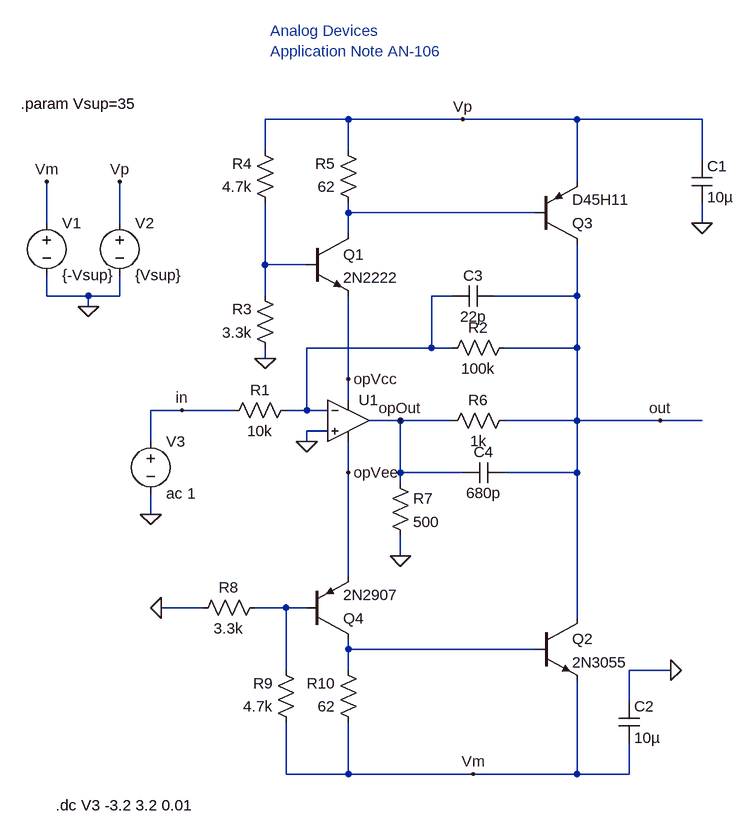
[diagram p0: schematic OpAmp_bootstrap.asc]
OpAmp_bootstrap.asc, the LTspice schematic file:
Version 4
SHEET 1 880 1008
WIRE 128 -64 0 -64
WIRE 304 -64 128 -64
WIRE 480 -64 304 -64
WIRE 672 -64 480 -64
WIRE 0 -16 0 -64
WIRE 128 -16 128 -64
WIRE 672 0 672 -64
WIRE 480 32 480 -64
WIRE 128 80 128 64
WIRE 416 80 128 80
WIRE -336 96 -336 32
WIRE -224 96 -224 32
WIRE 672 96 672 64
WIRE 128 112 128 80
WIRE 0 160 0 64
WIRE 64 160 0 160
WIRE -336 208 -336 176
WIRE -272 208 -336 208
WIRE -224 208 -224 176
WIRE -224 208 -272 208
WIRE 0 208 0 160
WIRE 288 208 256 208
WIRE 480 208 480 128
WIRE 480 208 352 208
WIRE -272 224 -272 208
WIRE 256 288 256 208
WIRE 256 288 64 288
WIRE 288 288 256 288
WIRE 480 288 480 208
WIRE 480 288 368 288
WIRE 0 304 0 288
WIRE 128 336 128 208
WIRE 128 368 128 336
WIRE -128 384 -176 384
WIRE -48 384 -128 384
WIRE 64 384 64 288
WIRE 64 384 32 384
WIRE 96 384 64 384
WIRE 208 400 160 400
WIRE 288 400 208 400
WIRE 480 400 480 288
WIRE 480 400 368 400
WIRE 608 400 480 400
WIRE 672 400 608 400
WIRE 96 416 64 416
WIRE -176 432 -176 384
WIRE 64 432 64 416
WIRE 128 480 128 432
WIRE 208 480 208 400
WIRE 304 480 208 480
WIRE 480 480 480 400
WIRE 480 480 368 480
WIRE 208 496 208 480
WIRE -176 544 -176 512
WIRE 208 608 208 576
WIRE 128 640 128 480
WIRE -96 688 -160 688
WIRE 32 688 -16 688
WIRE 64 688 32 688
WIRE 480 704 480 480
WIRE 128 752 128 736
WIRE 416 752 128 752
WIRE 32 784 32 688
WIRE 128 784 128 752
WIRE 624 784 560 784
WIRE 560 832 560 784
WIRE 32 944 32 864
WIRE 128 944 128 864
WIRE 128 944 32 944
WIRE 320 944 128 944
WIRE 480 944 480 800
WIRE 480 944 320 944
WIRE 560 944 560 896
WIRE 560 944 480 944
FLAG -272 224 0
FLAG -336 32 Vm
FLAG -224 32 Vp
FLAG -160 688 0
FLAG 0 304 0
FLAG 672 96 0
FLAG 624 784 0
FLAG 64 432 0
FLAG 208 608 0
FLAG -176 544 0
FLAG 320 944 Vm
FLAG 304 -64 Vp
FLAG 608 400 out
FLAG -128 384 in
FLAG 128 336 opVcc
FLAG 128 480 opVee
FLAG 208 400 opOut
SYMBOL Opamps\\UniversalOpamp2 128 400 R0
SYMATTR InstName U1
SYMBOL voltage -336 80 R0
WINDOW 123 0 0 Left 2
WINDOW 39 0 0 Left 2
SYMATTR InstName V1
SYMATTR Value {-Vsup}
SYMBOL voltage -224 80 R0
WINDOW 123 0 0 Left 2
WINDOW 39 0 0 Left 2
SYMATTR InstName V2
SYMATTR Value {Vsup}
SYMBOL npn 64 112 R0
SYMATTR InstName Q1
SYMATTR Value 2N2222
SYMBOL npn 416 704 R0
SYMATTR InstName Q2
SYMATTR Value 2N3055
SYMBOL pnp 416 128 M180
SYMATTR InstName Q3
SYMATTR Value D45H11
SYMBOL pnp 64 736 M180
SYMATTR InstName Q4
SYMATTR Value 2N2907
SYMBOL res 48 368 R90
WINDOW 0 0 56 VBottom 2
WINDOW 3 32 56 VTop 2
SYMATTR InstName R1
SYMATTR Value 10k
SYMBOL res 384 272 R90
WINDOW 0 0 56 VBottom 2
WINDOW 3 32 56 VTop 2
SYMATTR InstName R2
SYMATTR Value 100k
SYMBOL res 16 304 R180
WINDOW 0 36 76 Left 2
WINDOW 3 36 40 Left 2
SYMATTR InstName R3
SYMATTR Value 3.3k
SYMBOL res 16 80 R180
WINDOW 0 36 76 Left 2
WINDOW 3 36 40 Left 2
SYMATTR InstName R4
SYMATTR Value 4.7k
SYMBOL res 144 80 R180
WINDOW 0 36 76 Left 2
WINDOW 3 36 40 Left 2
SYMATTR InstName R5
SYMATTR Value 62
SYMBOL res 272 416 R270
WINDOW 0 32 56 VTop 2
WINDOW 3 0 56 VBottom 2
SYMATTR InstName R6
SYMATTR Value 1k
SYMBOL res 192 480 R0
SYMATTR InstName R7
SYMATTR Value 500
SYMBOL res 0 672 R90
WINDOW 0 0 56 VBottom 2
WINDOW 3 32 56 VTop 2
SYMATTR InstName R8
SYMATTR Value 3.3k
SYMBOL res 48 880 R180
WINDOW 0 36 76 Left 2
WINDOW 3 36 40 Left 2
SYMATTR InstName R9
SYMATTR Value 4.7k
SYMBOL res 144 880 R180
WINDOW 0 36 76 Left 2
WINDOW 3 36 40 Left 2
SYMATTR InstName R10
SYMATTR Value 62
SYMBOL cap 656 0 R0
SYMATTR InstName C1
SYMATTR Value 10µ
SYMBOL cap 544 832 R0
SYMATTR InstName C2
SYMATTR Value 10µ
SYMBOL cap 288 224 R270
WINDOW 0 32 32 VTop 2
WINDOW 3 0 32 VBottom 2
SYMATTR InstName C3
SYMATTR Value 22p
SYMBOL cap 368 464 R90
WINDOW 0 0 32 VBottom 2
WINDOW 3 32 32 VTop 2
SYMATTR InstName C4
SYMATTR Value 680p
SYMBOL voltage -176 416 R0
WINDOW 123 0 0 Left 2
WINDOW 39 0 0 Left 2
SYMATTR InstName V3
SYMATTR Value ac 1
TEXT -322 992 Left 2 !.dc V3 -3.2 3.2 0.01
TEXT -376 -88 Left 2 !.param Vsup=35
TEXT 8 -200 Left 2 ;Analog Devices\nApplication Note AN-106

The netlist it stands for:
* OpAmp_bootstrap.asc
XU1 0 N003 opVcc opVee opOut level.2 Avol=1Meg GBW=10Meg Slew=10Meg ilimit=25m rail=0 Vos=0 phimargin=45 en=0 enk=0 in=0 ink=0 Rin=500Meg  ; pins IN+ IN- V+ V- OUT
V1 Vm 0 {-Vsup}
V2 Vp 0 {Vsup}
Q1 N001 N002 opVcc 0 2N2222
Q2 out N005 Vm 0 2N3055
Q3 out N001 Vp 0 D45H11
Q4 N005 N004 opVee 0 2N2907
R1 N003 in 10k
R2 out N003 100k
R3 0 N002 3.3k
R4 N002 Vp 4.7k
R5 N001 Vp 62
R6 opOut out 1k
R7 opOut 0 500
R8 N004 0 3.3k
R9 Vm N004 4.7k
R10 Vm N005 62
C1 Vp 0 10µ
C2 0 Vm 10µ
C3 N003 out 22p
C4 out opOut 680p
V3 in 0 ac 1
.model NPN NPN
.model PNP PNP
.lib standard.bjt
.dc V3 -3.2 3.2 0.01
.param Vsup=35
* Analog Devices
* Application Note AN-106
.lib UniversalOpamps2.sub
.backanno
.end